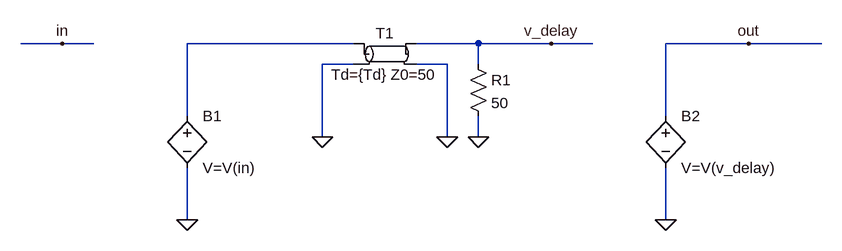
[diagram p0: schematic analog_delay.asc]
analog_delay.asc, the LTspice schematic file:
Version 4
SHEET 1 1492 680
WIRE -192 192 -256 192
WIRE -144 192 -192 192
WIRE 256 192 0 192
WIRE 448 192 352 192
WIRE 560 192 448 192
WIRE 624 192 560 192
WIRE 864 192 736 192
WIRE 976 192 864 192
WIRE 256 224 208 224
WIRE 400 224 352 224
WIRE 448 224 448 192
WIRE 0 304 0 192
WIRE 736 304 736 192
WIRE 208 336 208 224
WIRE 400 336 400 224
WIRE 448 336 448 304
WIRE 0 464 0 384
WIRE 736 464 736 384
FLAG -192 192 in
FLAG 400 336 0
FLAG 208 336 0
FLAG 448 336 0
FLAG 0 464 0
FLAG 736 464 0
FLAG 864 192 out
FLAG 560 192 v_delay
SYMBOL res 432 208 R0
SYMATTR InstName R1
SYMATTR Value 50
SYMBOL tline 304 208 R0
SYMATTR InstName T1
SYMATTR Value Td={Td} Z0=50
SYMBOL bv 0 288 R0
SYMATTR InstName B1
SYMATTR Value V=V(in)
SYMBOL bv 736 288 R0
SYMATTR InstName B2
SYMATTR Value V=V(v_delay)

The netlist it stands for:
* analog_delay.asc
R1 v_delay 0 50
T1 N001 0 v_delay 0 Td={Td} Z0=50
B1 N001 0 V=V(in)
B2 out 0 V=V(v_delay)
.backanno
.end